# Altium schematic sheet Radio.SchDoc
size A
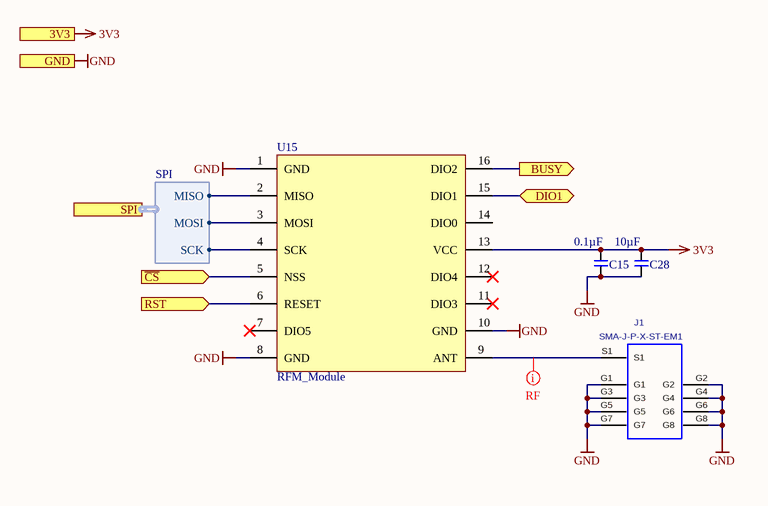
[diagram p0: Radio.SchDoc]

## Parts
C15  Capacitance (shorthand): 0.1µF  [C0603]  (hidden comment: 490-1519-1-ND)
C28  Capacitance (shorthand): 10µF  [C0603]  (hidden comment: 490-13248-1-ND)
J1  SMA-J-P-X-ST-EM1  [SMA-J-P-X-ST-EM1]
U15  RFM_Module  [RFM-22]

## Ports
3V3 (in), BUSY (out), DIO1 (bidir), GND (in), RST (in), SPI (harness SPI), ~{CS} (in)

## Harnesses
SPI: MISO, MOSI, SCK

## Nets
3V3: C15.1 C28.1 U15.13(VCC) ; port 3V3
GND: C15.2 C28.2 J1.G1 J1.G2 J1.G3 J1.G4 J1.G5 J1.G6 J1.G7 J1.G8 U15.1(GND) U15.8(GND) U15.10(GND) ; port GND
BUSY: U15.16(DIO2) ; port BUSY
~{CS}: U15.5(NSS) ; port ~{CS}
DIO1: U15.15(DIO1) ; port DIO1
RST: U15.6(RESET) ; port RST
NetJ1_S1: J1.S1 U15.9(ANT)
NetU15_2: U15.2(MISO) ; port SPI.MISO
NetU15_3: U15.3(MOSI) ; port SPI.MOSI
NetU15_4: U15.4(SCK) ; port SPI.SCK

Not connected (* = marked no-connect by the designer): U15 7(DIO5)* 11(DIO3)* 12(DIO4)* 14(DIO0)

## Layout directives
rule Clearance Constraint [Generic clearance = 30mil, and 10 value(s) for objects]: NetJ1_S1

## Library data of the parts
C15 = CMP-119-0065-1: CAP CER 0603 0.1µF X7R 50V 10%; Manufacturer: Murata Electronics North America; Capacitance - pF (Machine readable): #NAME?; Dielectric: X7R; Rated Voltage: 50V
C28 = CMP-119-0071-1: CAP CER 10UF 35V X5R 0603 20%; Manufacturer: Murata Electronics North America; Capacitance - pF (Machine readable): #NAME?; Rated Voltage: 35V; Dielectric: X5R
J1 = CMP-135-0000-2: SMA STRAIGHT, EDGE MOUNT JACK- 50 OHM; MANUFACTURER: SAMTEC; CREATED: APRIL 8 2014 - WENDY XIN; PCB DECAL: SMA-J-P-X-ST-EM1; Design Item ID: SMA-J-P-X-ST-EM1; Source: SMA-J-P-X-ST-EM1.SCHLIB
U15 = CMP-064-0007-1: Design Item ID: RFM_Module; Source: modules.SchLib